# Altium project Dev Board.PrjPcb (part 2 of 2)

## Sheet SH4-POWER.SchDoc: SH4-POWER
size Letter; DrawnBy: Christopher Arjune; SheetNumber: 4; SheetTotal: 4
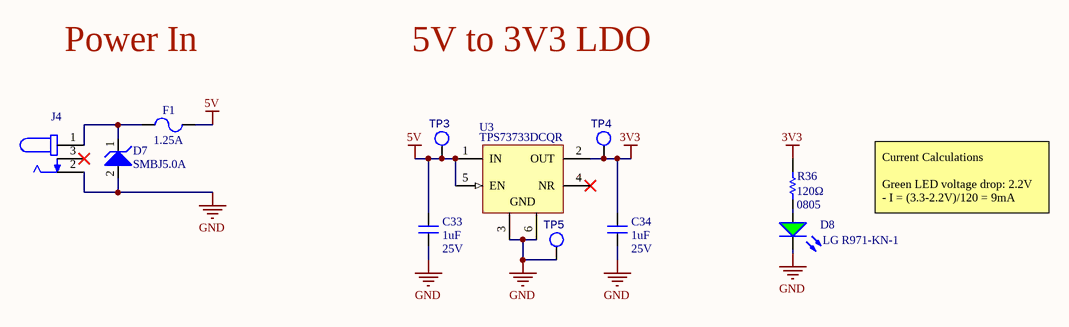
[diagram p3: SH4-POWER.SchDoc]

### Parts
C33  Capacitance: 1uF  Voltage Rating (DC): 25V  [CAPC2012X140N]
C34  Capacitance: 1uF  Voltage Rating (DC): 25V  [CAPC2012X140N]
D7  Manufacturer Part Number 1: SMBJ5.0A  [TVS_DIODE_BIDIRECTIONAL]  (hidden comment: TVS_DIODE_UNIDIR_5V)
D8  LG R971-KN-1  [LED_0805_LINE]
F1  Current Rating: 1.25A  [FUSE_1206]  (hidden comment: FUSE_1.25A_1206)
J4  PJ-102B  [CUI_PJ-102B]  (value not drawn)
R36  Case Code (Imperial): 0805  Resistance: 120Ω  [RESC2012X60N]  (hidden comment: 120)
TP3  TESTPOINT_LOOP  [TESTPOINT_LOOP]  (value not drawn)
TP4  TESTPOINT_LOOP  [TESTPOINT_LOOP]  (value not drawn)
TP5  TESTPOINT_LOOP  [TESTPOINT_LOOP]  (value not drawn)
U3  TPS73733DCQR  [SOT-223-6]

### Nets
3V3: C34.2 R36.2 TP4.1 U3.2(OUT)
5V: C33.1 F1.2 TP3.1 U3.1(IN) U3.5(EN)
GND: C33.2 C34.1 D7.2 D8.2(K) J4.2 TP5.1 U3.3(GND) U3.6(GND)
NetD7_1: D7.1 F1.1 J4.1
NetD8_1: D8.1(A) R36.1

Not connected (* = marked no-connect by the designer): J4 3*; U3 4(NR)*

### Notes on the sheet
- Power In
- 5V to 3V3 LDO
- Current Calculations
  Green LED voltage drop: 2.2V
  - I = (3.3-2.2V)/120 = 9mA
- Title
- Size:
- Date:
- Letter
- Drawn By:
- Sheet
- of
- File:

### Library data of the parts
C33 C34 = CAP_1uF_25V_0805: CAP CER 1UF 25V X7R 0805; Manufacturer 1: Murata; Manufacturer Part Number 1: GCM21BR71E105KA56K; Tolerance: 10%; Supplier 1: Digi-Key; Stock 1: 31473; Pricing 1: 1=0.34000, 10=0.23600, 100=0.13360, 500=0.09432, 1000=0.08254, 2500=0.07861, 5000=0.07271 (USD); RoHS: Yes; Mount: Surface Mount; Case/Package: 0805; Case Code (Metric): 2012; Case Code (Imperial): 0805; Min Operating Temperature: -55°C; Max Operating Temperature: 125°C; Package Quantity: 10000; Voltage Rating: 25V; Packaging: Tape and Reel; Dielectric: X7R; Termination: SMD/SMT; Length: 2mm; Height: 1.25mm; Width: 0.049inch; Thickness: 0.055inch; Depth: 1.25mm; Ratings: AEC-Q200; Radiation Hardening: No; ComponentLink1URL: https://datasheet.ciiva.com/169/product-169236.pdf?src-supplier=Digi-Key; ComponentLink1Description: https://datasheet.ciiva.com/169/product-169236.pdf?src-supplier=Digi-Key; ComponentLink2URL: https://datasheet.ciiva.com/11616/product-11616618.pdf?src-supplier=Avnet; ComponentLink2Description: https://datasheet.ciiva.com/11616/product-11616618.pdf?src-supplier=Avnet; Supplier Part Number 1: 490-14743-1-ND
D7 = TVS_DIODE_UNIDIR_5V: TVS DIODE 5V 9.2V DO214AA; Manufacturer 1: Bourns; Max Power Dissipation: 600W; Polarity: Unidirectional; Number of Elements: 1; Leakage Current: 800uA; Reverse Breakdown Voltage: 6.4V; Max Surge Current: 100A; Breakdown Voltage: 7.25V; Peak Pulse Current: 65.2A; Test Current: 10mA; Element Configuration: Single; Operating Supply Voltage: 3.5V; Power Line Protection: No; ESD Protection: Yes; Supplier 1: Digi-Key; Stock 1: 3797; Pricing 1: 1=0.39000, 10=0.29300, 25=0.26440, 100=0.13950, 250=0.13804, 500=0.12362, 1000=0.09620 (USD); RoHS: Yes; Mount: Surface Mount; Case/Package: SMB; Number of Pins: 2; Min Operating Temperature: -55°C; Max Operating Temperature: 150°C; Packaging: Tape and Reel; Package Quantity: 1; Direction: Unidirectional; Reverse Standoff Voltage: 5V; Min Breakdown Voltage: 6.4V; Clamping Voltage: 9.2V; Peak Pulse Power: 600W; Termination: SMD/SMT; Max Breakdown Voltage: 7.25V; Number of Channels: 1; Max Reverse Leakage Current: 800uA; Number of Unidirectional Channels: 1; Composition: Zener; Length: 4.57mm; Height: 2.42mm; Width: 3.94mm; Radiation Hardening: No; REACH SVHC: No SVHC; ComponentLink1URL: https://datasheet.ciiva.com/25624/0900766b81122151-25624859.pdf?src-supplier=RSComponents; ComponentLink1Description: https://datasheet.ciiva.com/25624/0900766b81122151-25624859.pdf?src-supplier=RSComponents; ComponentLink2URL: https://datasheet.ciiva.com/5749/1677318-5749456.pdf?src-supplier=Farnell; ComponentLink2Description: https://datasheet.ciiva.com/5749/1677318-5749456.pdf?src-supplier=Farnell; ComponentLink3URL: https://datasheet.ciiva.com/334/smbj-334066.pdf?src-supplier=Digi-Key; ComponentLink3Description: https://datasheet.ciiva.com/334/smbj-334066.pdf?src-supplier=Digi-Key; ComponentLink4URL: https://datasheet.ciiva.com/17413/smbj-17413462.pdf?src-supplier=Avnet+Europe; ComponentLink4Description: https://datasheet.ciiva.com/17413/smbj-17413462.pdf?src-supplier=Avnet+Europe; ComponentLink5URL: https://datasheet.ciiva.com/3021/smbj-3021451.pdf?src-supplier=Avnet; ComponentLink5Description: https://datasheet.ciiva.com/3021/smbj-3021451.pdf?src-supplier=Avnet; ComponentLink6URL: https://datasheet.ciiva.com/3021/smbj-3021452.pdf?src-supplier=Avnet; ComponentLink6Description: https://datasheet.ciiva.com/3021/smbj-3021452.pdf?src-supplier=Avnet; Supplier Part Number 1: SMBJ5.0ABCT-ND; ComponentLink8URL: https://datasheet.ciiva.com/30094/smbj-30094061.pdf?src-supplier=Onlinecomponents.com; ComponentLink8Description: https://datasheet.ciiva.com/30094/smbj-30094061.pdf?src-supplier=Onlinecomponents.com; ComponentLink9URL: https://datasheet.ciiva.com/334/smbj-334064.pdf?src-supplier=Digi-Key; ComponentLink9Description: https://datasheet.ciiva.com/334/smbj-334064.pdf?src-supplier=Digi-Key; ComponentLink10URL: https://datasheet.ciiva.com/334/smbj-334065.pdf?src-supplier=Digi-Key; ComponentLink10Description: https://datasheet.ciiva.com/334/smbj-334065.pdf?src-supplier=Digi-Key; ComponentLink11URL: https://datasheet.ciiva.com/4510/smbj-51809-4510005.pdf?src-supplier=Mouser; ComponentLink11Description: https://datasheet.ciiva.com/4510/smbj-51809-4510005.pdf?src-supplier=Mouser; ComponentLink12URL: https://datasheet.ciiva.com/8031/1677318-8031160.pdf?src-supplier=Element14; ComponentLink12Description: https://datasheet.ciiva.com/8031/1677318-8031160.pdf?src-supplier=Element14; ComponentLink13URL: https://datasheet.ciiva.com/48712/001056320-da-01-en-tvs-diode-smbj5-0a-do-214aa-bou-48712572.pdf?src-supplier=Conrad; ComponentLink13Description: https://datasheet.ciiva.com/48712/001056320-da-01-en-tvs-diode-smbj5-0a-do-214aa-bou-48712572.pdf?src-supplier=Conrad
D8 = DIO_LED_G: LED GREEN DIFFUSED 0805 SMD; Manufacturer 1: OSRAM; Forward Voltage Drop: 2.2V; Package: 0805 (2012 Metric); Manufacturer Part Number 1: LG R971-KN-1; Supplier Part Number 1: 475-1410-1-ND; Supplier 1: Digi-Key; Mount: Surface Mount
F1 = FUSE_1.25A_1206: FUSE SMD 1.25A 63V; Manufacturer 1: Littelfuse; Manufacturer Part Number 1: 04661.25NRHF; Fuse Type: Board Mount (Cartridge Style Excluded); DC Cold Resistance: 59mR; Approvals: UL,CSA; Supplier 1: Digi-Key; Stock 1: 5020; Pricing 1: 1=0.84000, 5=0.81200, 10=0.78700, 50=0.66180, 100=0.54930, 250=0.49940, 500=0.42450, 1000=0.37455 (USD); RoHS: No; Mount: Surface Mount; Case/Package: 1206; Case Code (Imperial): 1206; Case Code (Metric): 3216; Min Operating Temperature: -55°C; Max Operating Temperature: 90°C; Packaging: Tape and Reel; Voltage Rating (AC): 63V; Voltage Rating (DC): 63V; ComponentLink1URL: https://www.littelfuse.com/~/media/electronics/datasheets/fuses/littelfuse_fuse_466_datasheet.pdf.pdf?src-supplier=Digi-Key; ComponentLink1Description: https://www.littelfuse.com/~/media/electronics/datasheets/fuses/littelfuse_fuse_466_datasheet.pdf.pdf?src-supplier=Digi-Key; Supplier Part Number 1: F11418CT-ND
J4 = PJ-102B: 2.5 x 6.5 mm, 2.5 A, Horizontal, Through Hole, Tapered Pins, Dc Power Jack Connector; Manufacturer 1: CUI; Gender: Male; Shielding: Unshielded; Current Rating: 2.5A; Voltage Rating: 24V; Insulation Resistance: 100MR; Number of Conductors: 2; Supplier 1: Digi-Key; Manufacturer Part Number 1: PJ-102B; Stock 1: 71721; Pricing 1: 1=0.64000, 10=0.60000, 25=0.54000, 50=0.48000, 100=0.46000, 250=0.42000, 500=0.40000, 1000=0.33000, 2500=0.30000 (USD); RoHS: Yes; Mount: Through Hole; Color: Black; Contact Plating: Nickel; Contact Material: Copper; Housing Material: Thermoplastic; Housing Color: Black; Min Operating Temperature: -25°C; Max Operating Temperature: 85°C; Termination: Through Hole; Connector Type: Jack; Package Quantity: 280; Contact Gender: Male; Orientation: Horizontal; Packaging: Bulk; Diameter: 2.5mm; Lead Free: Lead Free; Flammability Rating: UL94 V-0; ComponentLink1URL: http://www.mouser.com/ds/2/670/PJ-102B-524146.pdf?src-supplier=Mouser; ComponentLink1Description: http://www.mouser.com/ds/2/670/PJ-102B-524146.pdf?src-supplier=Mouser; ComponentLink2URL: https://www.cui.com/product/resource/digikeypdf/pj-102b.pdf?src-supplier=Digi-Key; ComponentLink2Description: https://www.cui.com/product/resource/digikeypdf/pj-102b.pdf?src-supplier=Digi-Key; ComponentLink3URL: http://www.cui.com/Product/Resource/FuturePDF/PJ-102B.pdf?src-supplier=Future+Electronics; ComponentLink3Description: http://www.cui.com/Product/Resource/FuturePDF/PJ-102B.pdf?src-supplier=Future+Electronics; Supplier Part Number 1: CP-102B-ND
R36 = RES_120Ω_0805: RES SMD 120 OHM 1% 1/8W 0805; Manufacturer 1: Vishay; Manufacturer Part Number 1: CRCW0805120RFKEA; Power Rating: 125mW; Voltage Rating: 150V; ComponentLink1URL: https://datasheet.ciiva.com/11810/0900766b80d98b26-11810477.pdf?src-supplier=RSComponents; ComponentLink1Description: https://datasheet.ciiva.com/11810/0900766b80d98b26-11810477.pdf?src-supplier=RSComponents; ComponentLink2URL: https://datasheet.ciiva.com/3258/dcrcwe3-3258069.pdf?src-supplier=Avnet; ComponentLink2Description: https://datasheet.ciiva.com/3258/dcrcwe3-3258069.pdf?src-supplier=Avnet; ComponentLink3URL: https://datasheet.ciiva.com/26317/fld-crcw-e3-data-en-26317334.pdf?src-supplier=Distrelec; ComponentLink3Description: https://datasheet.ciiva.com/26317/fld-crcw-e3-data-en-26317334.pdf?src-supplier=Distrelec; ComponentLink4URL: https://datasheet.ciiva.com/2467/dcrcwe3-2467512.pdf?src-supplier=Digi-Key; ComponentLink4Description: https://datasheet.ciiva.com/2467/dcrcwe3-2467512.pdf?src-supplier=Digi-Key; ComponentLink5URL: https://datasheet.ciiva.com/2467/dcrcwe3-2467514.pdf?src-supplier=Digi-Key; ComponentLink5Description: https://datasheet.ciiva.com/2467/dcrcwe3-2467514.pdf?src-supplier=Digi-Key; ComponentLink6URL: https://datasheet.ciiva.com/16211/dcrcwe3-16211931.pdf?src-supplier=Future+Electronics; ComponentLink6Description: https://datasheet.ciiva.com/16211/dcrcwe3-16211931.pdf?src-supplier=Future+Electronics; ComponentLink7URL: https://datasheet.ciiva.com/2467/dcrcwe3-2467513.pdf?src-supplier=Digi-Key; ComponentLink7Description: https://datasheet.ciiva.com/2467/dcrcwe3-2467513.pdf?src-supplier=Digi-Key; ComponentLink8URL: https://datasheet.ciiva.com/16852/dcrcwe3-16852841.pdf?src-supplier=Avnet+Europe; ComponentLink8Description: https://datasheet.ciiva.com/16852/dcrcwe3-16852841.pdf?src-supplier=Avnet+Europe; ComponentLink9URL: https://datasheet.ciiva.com/7777/1697337-7777354.pdf?src-supplier=Element14; ComponentLink9Description: https://datasheet.ciiva.com/7777/1697337-7777354.pdf?src-supplier=Element14; ComponentLink10URL: https://datasheet.ciiva.com/16788/70201119-16788154.pdf?src-supplier=Allied+Electronics; ComponentLink10Description: https://datasheet.ciiva.com/16788/70201119-16788154.pdf?src-supplier=Allied+Electronics; ComponentLink11URL: https://datasheet.ciiva.com/7777/1720486-7777567.pdf?src-supplier=Element14; ComponentLink11Description: https://datasheet.ciiva.com/7777/1720486-7777567.pdf?src-supplier=Element14; Supplier 1: Digi-Key; Mount: Surface Mount; Case Code (Metric): 2012; Supplier Part Number 1: 541-120CCT-ND; Package: 0805 (2012 Metric)
TP3-TP5 = TESTPOINT_LOOP: Loop testpoint through-hole pad; Manufacturer 1: Keystone Electronics; Manufacturer Part Number 1: 5002; Supplier Part Number 1: 36-5002-ND; Supplier 1: Digi-Key; Mount: Through Hole
U3 = CMP-0395-00300-2: IC REG LINEAR 3.3V 1A SOT223-6; Manufacturer: Texas Instruments; Fixed Output Options(V): 3.3; Vdo(Typ)(mV): 130; Iout(Max)(A): 1; Accuracy(%): 3; SubFamily: Single Channel LDO; Eco-Plan: Green (RoHS & no Sb/Br); Vin(Min)(V): 2.2; Vin(Max)(V): 5.5; Rating: Catalog; Iq(Typ)(mA): 0.3; PartNumber: TPS73733DCQR; DatasheetVersion: SBVS067O; PackageReference: DCQ0006A; PackageDescription: 6-Pin Plastic Small Outline, Body 3.5 x 6.5 mm, Pitch 1.27 mm; PackageVersion: 4202109/D; Vout Adj(Min)(V): 3.3; Vout Adj(Max)(V): 3.3; Mounting Technology: Surface Mount; Supplier 1: Digi-Key; Supplier Part Number 1: 296-22681-2-ND; Manufacturer 1: Texas Instruments; Manufacturer Part Number 1: TPS73733DCQR

## Nets that join several sheets
3V3: SH1-MCU (19 pins), SH2-CONTROLS (13 pins), SH3-FTDI (9 pins), SH4-POWER (C34.2 R36.2 TP4.1 U3.2)
GND: SH1-MCU (24 pins), SH2-CONTROLS (24 pins), SH3-FTDI (12 pins), SH4-POWER (8 pins)
NetC14_2: SH1-MCU (U1.25), SH2-CONTROLS (C14.2 R10.2)
NetC15_2: SH1-MCU (U1.24), SH2-CONTROLS (C15.2 R13.2)
NetC16_2: SH1-MCU (U1.37), SH2-CONTROLS (C16.2 R14.2)
NetC17_2: SH1-MCU (U1.38), SH2-CONTROLS (C17.2 R15.2)
NetC18_2: SH1-MCU (U1.39), SH2-CONTROLS (C18.2 R20.2)
NetC19_2: SH1-MCU (U1.40), SH2-CONTROLS (C19.2 R22.2)
NetC20_2: SH1-MCU (U1.20), SH2-CONTROLS (C20.2 R17.2)
NetC21_2: SH1-MCU (U1.21), SH2-CONTROLS (C21.2 R21.2)
NetC22_2: SH1-MCU (U1.22), SH2-CONTROLS (C22.2 R23.2)
NetC23_2: SH1-MCU (U1.15), SH2-CONTROLS (C23.2 R25.2)
NetC24_2: SH1-MCU (U1.35), SH2-CONTROLS (C24.2 R26.2)
NetC25_2: SH1-MCU (U1.16), SH2-CONTROLS (C25.2 R27.2)
NetC26_2: SH1-MCU (U1.36), SH2-CONTROLS (C26.2 R29.2)
NetR35_1: SH1-MCU (U1.44), SH3-FTDI (R35.1 U2.11)
NetTP6_1: SH1-MCU (TP6.1 U1.42), SH3-FTDI (U2.4)
NetTP7_1: SH1-MCU (TP7.1 U1.43), SH3-FTDI (U2.1)